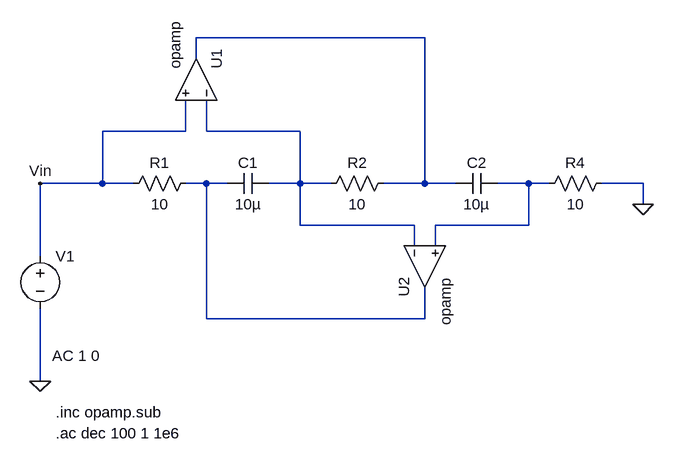
[diagram p0: schematic EJ5_GIC_FDNR.asc]
EJ5_GIC_FDNR.asc, the LTspice schematic file:
Version 4
SHEET 1 880 680
WIRE 448 -48 96 -48
WIRE 96 -16 96 -48
WIRE 80 96 80 48
WIRE 80 96 -48 96
WIRE 112 96 112 48
WIRE 256 96 112 96
WIRE -48 176 -48 96
WIRE -48 176 -144 176
WIRE 0 176 -48 176
WIRE 112 176 80 176
WIRE 144 176 112 176
WIRE 256 176 256 96
WIRE 256 176 208 176
WIRE 304 176 256 176
WIRE 448 176 448 -48
WIRE 448 176 384 176
WIRE 496 176 448 176
WIRE 608 176 560 176
WIRE 640 176 608 176
WIRE 784 176 720 176
WIRE 784 208 784 176
WIRE 256 240 256 176
WIRE 432 240 256 240
WIRE 608 240 608 176
WIRE 608 240 464 240
WIRE 432 272 432 240
WIRE 464 272 464 240
WIRE -144 288 -144 176
WIRE 112 384 112 176
WIRE 448 384 448 336
WIRE 448 384 112 384
WIRE -144 480 -144 368
FLAG -144 480 0
FLAG -144 176 Vin
FLAG 784 208 0
SYMBOL res -16 192 R270
WINDOW 0 32 56 VTop 2
WINDOW 3 0 56 VBottom 2
SYMATTR InstName R1
SYMATTR Value 10
SYMBOL res 400 160 R90
WINDOW 0 0 56 VBottom 2
WINDOW 3 32 56 VTop 2
SYMATTR InstName R2
SYMATTR Value 10
SYMBOL res 736 160 R90
WINDOW 0 0 56 VBottom 2
WINDOW 3 32 56 VTop 2
SYMATTR InstName R4
SYMATTR Value 10
SYMBOL cap 208 160 R90
WINDOW 0 0 32 VBottom 2
WINDOW 3 32 32 VTop 2
SYMATTR InstName C1
SYMATTR Value 10µ
SYMBOL Opamps\\opamp 160 16 M270
SYMATTR InstName U1
SYMATTR SpiceLine Aol=1000K
SYMATTR SpiceLine2 GBW=100000Meg
SYMBOL Opamps\\opamp 384 304 M90
SYMATTR InstName U2
SYMATTR SpiceLine Aol=1000K
SYMATTR SpiceLine2 GBW=100000Meg
SYMBOL voltage -144 272 R0
WINDOW 3 20 138 Left 2
WINDOW 123 18 169 Left 2
WINDOW 39 0 0 Left 0
SYMATTR Value ""
SYMATTR Value2 AC 1 0
SYMATTR InstName V1
SYMBOL cap 560 160 R90
WINDOW 0 0 32 VBottom 2
WINDOW 3 32 32 VTop 2
SYMATTR InstName C2
SYMATTR Value 10µ
TEXT -120 528 Left 2 !.inc opamp.sub
TEXT -120 560 Left 2 !.ac dec 100 1 1e6

The netlist it stands for:
* EJ5_GIC_FDNR.asc
R1 Vin N003 10
R2 N001 N002 10
R4 0 N004 10
C1 N002 N003 10µ
XU1 N002 Vin N001 opamp Aol=1000K GBW=100000Meg  ; pins invin noninvin out
XU2 N002 N004 N003 opamp Aol=1000K GBW=100000Meg  ; pins invin noninvin out
V1 Vin 0 AC 1 0
C2 N004 N001 10µ
.inc opamp.sub
.ac dec 100 1 1e6
.backanno
.end